# Altium project CSN_Edu_Mod.PrjPCB
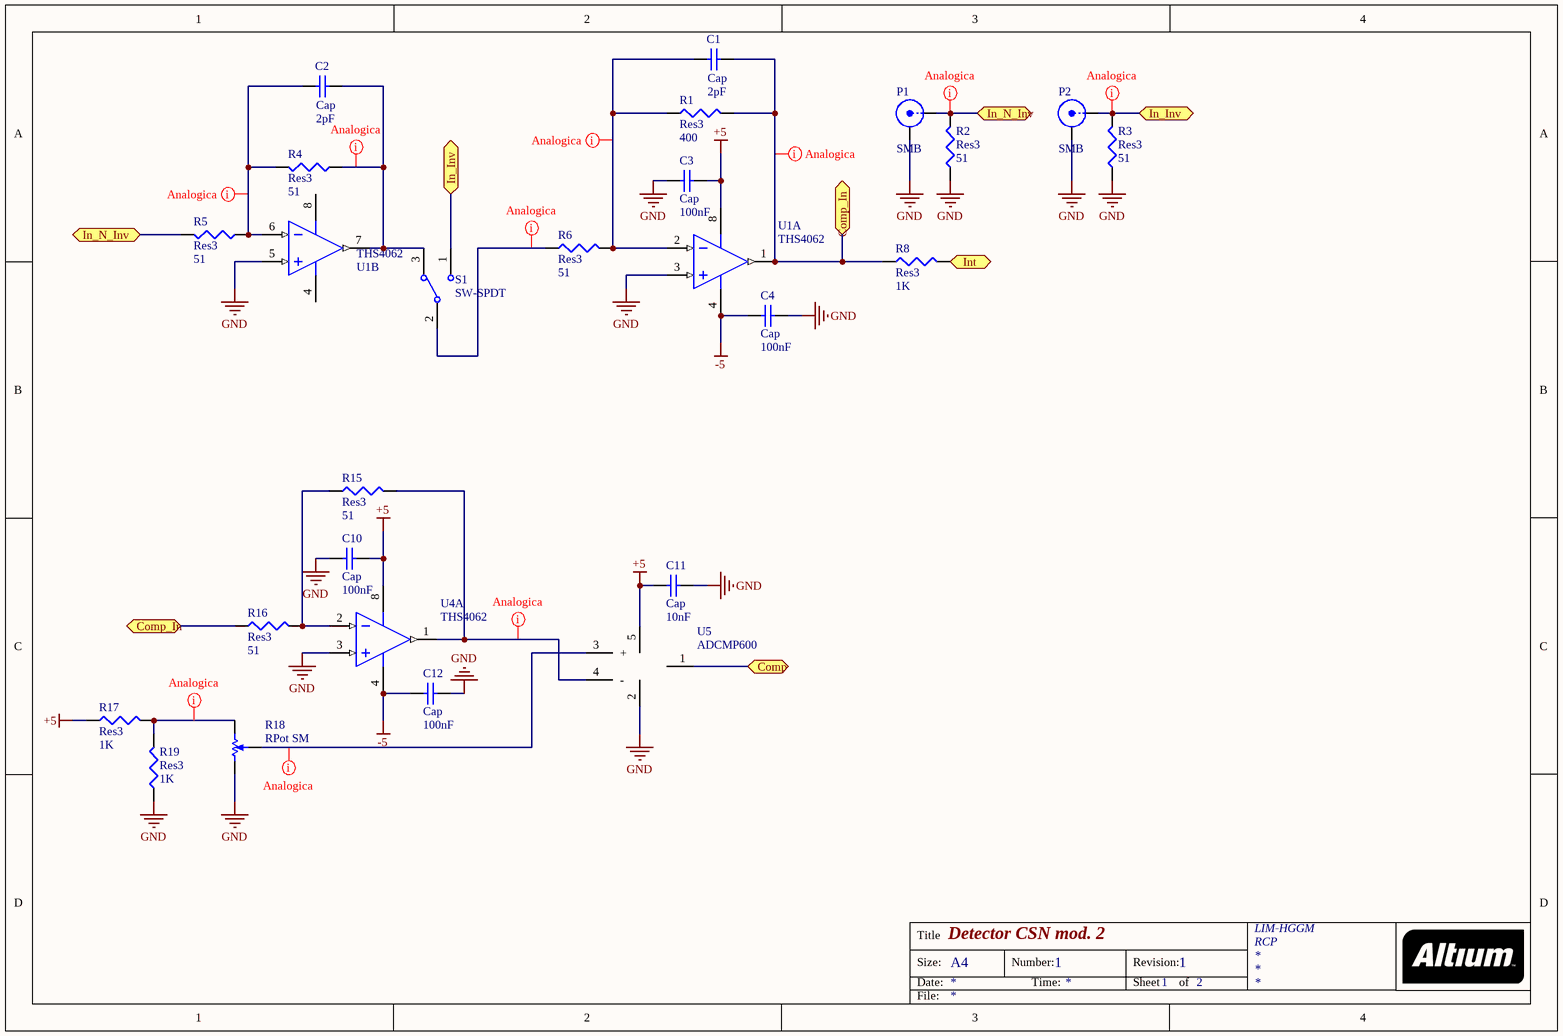
[diagram p0: Sheet1.SchDoc]
2 sheets, 44 parts. Net scope: flat (ports and power ports of the same name join across sheets).
Board file: PCB1.PcbDoc
Sheets:
  Sheet1.SchDoc
  Sheet2.SchDoc

## Sheet Sheet1.SchDoc: Detector CSN mod. 2
size A4; DrawnBy: RCP; Engineer: RCP; Organization: LIM-HGGM; Address1: RCP; DocumentNumber: 1; Revision: 1; SheetNumber: 1; SheetTotal: 2; PageSetup: Record=PageOptions|CenterHorizontal=True|CenterVertical=True|PrintScale=0.97|XCorrection=1.00|YCorrection=1.00|PrintKind=0|BorderSize=5000000|LeftOffset=0|BottomOffset=0|Orientation=2|PaperLength=1000|PaperWidth=1000|Scale=100|PaperSource=7|PrintQuality=-4|MediaType=1|DitherType=10|PaperKind=A4|PrintScaleMode=1

### Parts
C1  Cap  value 2pF  [6-0805_N]
C2  Cap  value 2pF  [6-0805_N]
C3  Cap  value 100nF  [6-0805_N]
C4  Cap  value 100nF  [6-0805_N]
C10  Cap  value 100nF  [6-0805_N]
C11  Cap  value 10nF  [6-0805_N]
C12  Cap  value 100nF  [6-0805_N]
P1  SMB  [SMB_V-RJ45]
P2  SMB  [SMB_V-RJ45]
R1  Res3  value 400  [6-0805_N]
R2  Res3  value 51  [6-0805_N]
R3  Res3  value 51  [6-0805_N]
R4  Res3  value 51  [6-0805_N]
R5  Res3  value 51  [6-0805_N]
R6  Res3  value 51  [6-0805_N]
R8  Res3  value 1K  [6-0805_N]
R15  Res3  value 51  [6-0805_N]
R16  Res3  value 51  [6-0805_N]
R17  Res3  value 1K  [6-0805_N]
R18  RPot SM  [POT4MM-2]
R19  Res3  value 1K  [6-0805_N]
S1  SW-SPDT  [HDR1X3]
U1  THS4062  [S8_N]  (parts A,B of 2)
U4  THS4062  [S8_N]  (part A of 2)
U5  ADCMP600  [SOT23-5_N]

### Ports
Comp, Comp_In, In_Inv, In_N_Inv, Int (out)

### Nets
+5: C3.2 C10.2 C11.1 R17.1 U1.8(V+) U4.8(V+) U5.5
-5: C4.1 C12.1 U1.4(V-) U4.4(V-)
GND: C3.1 C4.2 C10.1 C11.2 C12.2 P1.2(Y) P2.2(Y) R2.1 R3.1 R18.CCW(-) R19.1 U1.3(IN+) U1.5(IN+) U4.3(IN+) U5.2
NetC1_1: C1.1 R1.1 R6.2 U1.2(IN-)
NetC1_2: C1.2 R1.2 R8.1 R16.1 U1.1(OUT) ; port Comp_In
NetC2_1: C2.1 R4.2 R5.1 U1.6(IN-)
NetC2_2: C2.2 R4.1 S1.3 U1.7(OUT)
NetC14_1: R8.2 ; port Int
NetP1_1: P1.1(X) R2.2 R5.2 ; port In_N_Inv
NetP2_1: P2.1(X) R3.2 S1.1 ; port In_Inv
NetP5_6: U5.1 ; port Comp
NetR6_1: R6.1 S1.2
NetR15_1: R15.1 R16.2 U4.2(IN-)
NetR15_2: R15.2 U4.1(OUT) U5.4(-)
NetR17_2: R17.2 R18.CW(+) R19.2
NetR18_W: R18.W U5.3(+)

### Layout directives
net class analog: NetC1_1, NetC1_2, NetC2_1, NetC2_2, NetP1_1, NetP2_1, NetR6_1, NetR15_2, NetR17_2, NetR18_W

### Notes on the sheet
- Title
- Size:
- Date:
- A4
- Number:
- Time:
- Revision:
- Sheet
- of
- File:

### Library data of the parts
C1-C4 C10-C12 = Cap: Capacitor; Published: 8-Jun-2000; LatestRevisionDate: 17-Jul-2002; LatestRevisionNote: Re-released for DXP Platform.; PackageReference: RAD-0.3; Publisher: Altium Limited; PackageDescription: Radial Cap, Thru-Hole; 2 Leads; 0.3 in Pin Spacing
P1 P2 = SMB: SMB Straight Connector; LatestRevisionDate: 17-Jul-2002; LatestRevisionNote: Re-released for DXP Platform.; Publisher: Altium Limited
R1-R6 R8 R15-R17 R19 = Res3: Resistor; Published: 8-Jun-2000; LatestRevisionDate: 29-May-2009; LatestRevisionNote: IPC-7351 Footprint Added.; PackageReference: J1-0603; Publisher: Altium Limited; PackageDescription: Chip Resistor
R18 = RPot SM: Square Trimming Potentiometer; Published: 17-Dec-2003; DatasheetVersion: Oct-2003; PackageReference: POT4MM-2; Publisher: Altium Limited; PackageDescription: Square Trimming Potentiometer; ComponentLink1Description: Manufacturer Link; ComponentLink1URL: http://bourns.com/2/search.html
S1 = SW-SPDT: SPDT Subminiature Toggle Switch, Right Angle Mounting, Vertical Actuation; Published: 24-Mar-1999; LatestRevisionDate: 17-Dec-2003; LatestRevisionNote: Schematic revised, PCB Footprint replaced.; DatasheetVersion: 05-Dec-2000; PackageReference: TL36WW15050; Publisher: Altium Limited; PackageDescription: Switch; 4 Leads; ComponentLink1Description: Manufacturer Link; ComponentLink1URL: http://www.apem.com
U1 U4 = LT1253CS8: Low Cost Dual Video Amplifier; Note: 1003; Published: 8-Jun-2000; LatestRevisionDate: 13-Apr-2006; LatestRevisionNote: IPC-7351 Footprint Added.; DatasheetVersion: 1996; PackageReference: S8; Publisher: Altium Limited; PackageDescription: 8-Pin Small Outline Integrated Circuit 1.27 mm Pitch; Code_JEDEC: MS-012-AA; Code_IPC: SOIC127P600-8; ComponentLink1Description: Manufacturer Link; ComponentLink1URL: http://www.linear.com/; ComponentLink2Description: Datasheet; ComponentLink2URL: http://www.linear.com/pc/downloadDocument.do?navId=H0,C1,C1154,C1009,C1022,P1423,D1129

## Sheet Sheet2.SchDoc: Detector CSN mod. 2
size A4; DrawnBy: RCP; Engineer: RCP; Organization: LIM-HGGM; Address1: RCP; DocumentNumber: 1; Revision: 1; SheetNumber: 2; SheetTotal: 2
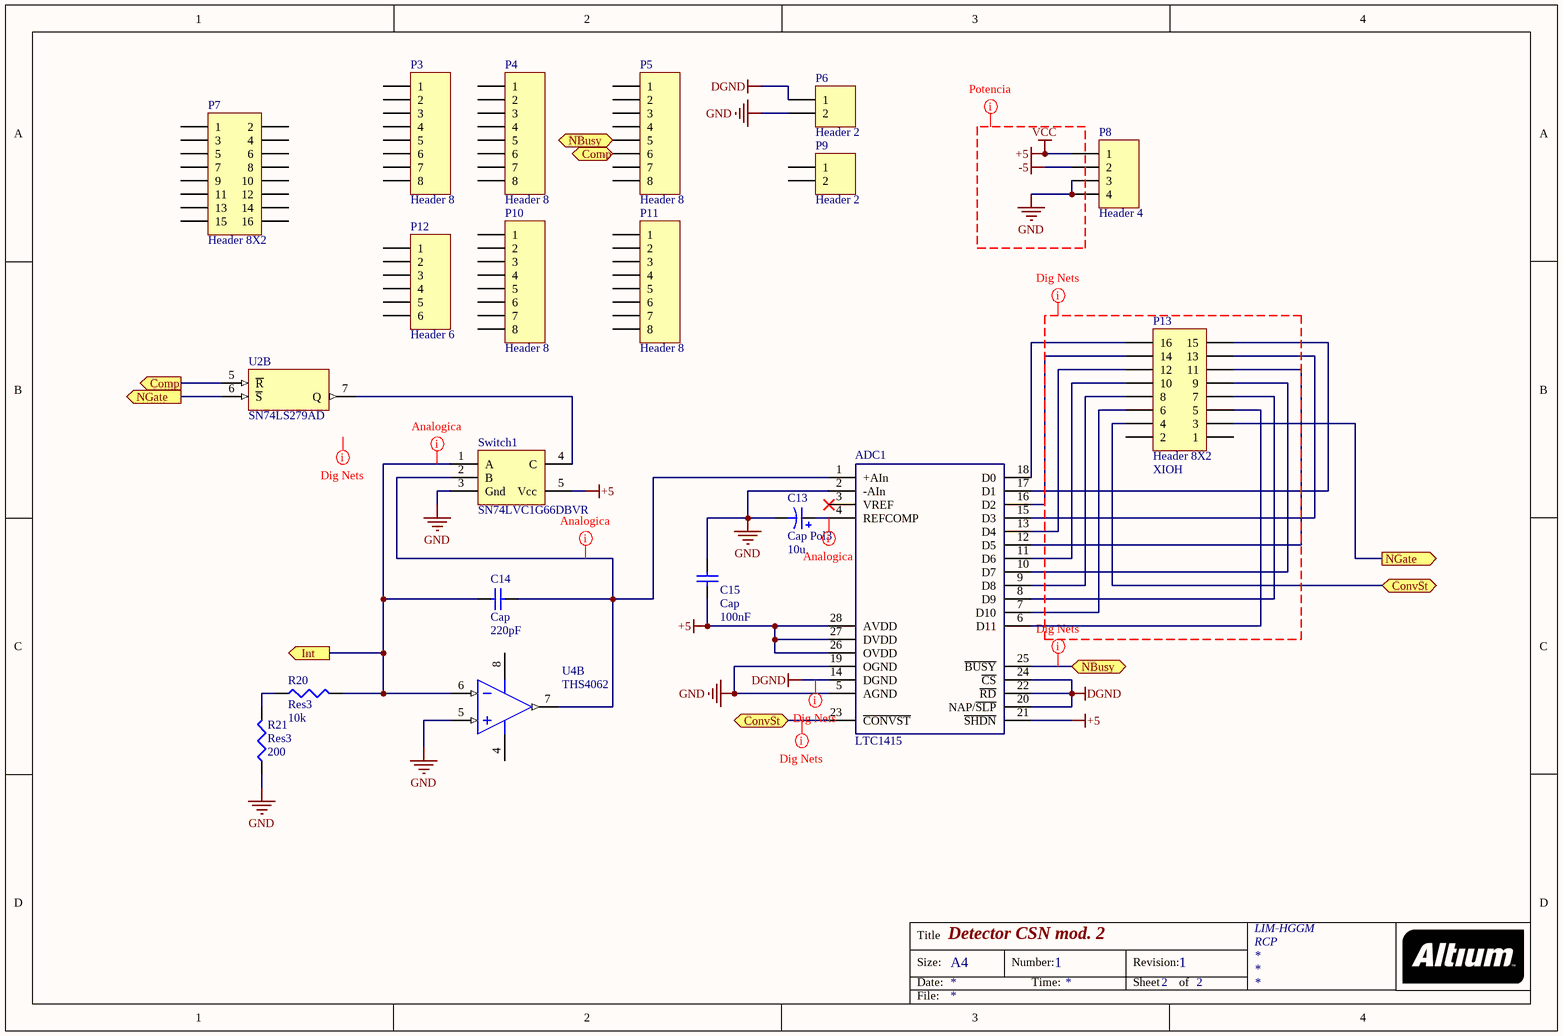
[diagram p1: Sheet2.SchDoc]

### Parts
ADC1  LTC1415  [SO28_N]
C13  Cap Pol3  value 10u  [C0805]
C14  Cap  value 220pF  [6-0805_N]
C15  Cap  value 100nF  [6-0805_N]
P3  Header 8  [HDR1X8]
P4  Header 8  [HDR1X8]
P5  Header 8  [HDR1X8]
P6  Header 2  [HDR1X2]
P7  Header 8X2  [HDR2X8]
P8  Header 4  [HDR1X4]
P9  Header 2  [HDR1X2]
P10  Header 8  [HDR1X8]
P11  Header 8  [HDR1X8]
P12  Header 6  [HDR1X6]
P13  Header 8X2  Con_Arduino: XIOH  [HDR2X8]
R20  Res3  value 10k  [6-0805_N]
R21  Res3  value 200  [6-0805_N]
Switch1  SN74LVC1G66DBVR  [SOT23-5_N]
U2  SN74LS279AD  [D016_N]  (part B of 4)
U4  THS4062  [S8_N]  (part B of 2)

### Ports
Comp (out), ConvSt, Int (out), NBusy, NGate (out)

### Nets
+5: ADC1.21(~{SHDN}) ADC1.26(OVDD) ADC1.27(DVDD) ADC1.28(AVDD) C15.1 P8.1 Switch1.5(Vcc) U2.16(VCC) U4.8(V+)  [also labelled VCC]
-5: P8.2 U4.4(V-)
DGND: ADC1.14(DGND) ADC1.20(NAP/~{SLP}) ADC1.22(~{RD}) ADC1.24(~{CS}) P6.1
GND: ADC1.2(-AIn) ADC1.5(AGND) ADC1.19(OGND) C13.2 C15.2 P6.2 P8.3 P8.4 R21.1 Switch1.3(Gnd) U2.8(GND) U4.5(IN+)
NetADC1_1: ADC1.1(+AIn) C14.2 Switch1.2(B) U4.7(OUT)
NetADC1_4: ADC1.4(REFCOMP) C13.1
NetADC1_6: ADC1.6(D11) P13.5
NetADC1_7: ADC1.7(D10) P13.6
NetADC1_8: ADC1.8(D9) P13.7
NetADC1_9: ADC1.9(D8) P13.8
NetADC1_10: ADC1.10(D7) P13.9
NetADC1_11: ADC1.11(D6) P13.10
NetADC1_12: ADC1.12(D5) P13.11
NetADC1_13: ADC1.13(D4) P13.12
NetADC1_15: ADC1.15(D3) P13.13
NetADC1_16: ADC1.16(D2) P13.14
NetADC1_17: ADC1.17(D1) P13.15
NetADC1_18: ADC1.18(D0) P13.16
NetADC1_23: ADC1.23(~{CONVST}) P13.4 ; port ConvSt
NetADC1_25: ADC1.25(~{BUSY}) P5.5 ; port NBusy
NetC14_1: C14.1 R20.2 Switch1.1(A) U4.6(IN-) ; port Int
NetP5_6: P5.6 U2.5(~{R}) ; port Comp
NetP13_3: P13.3 U2.6(~{S}) ; port NGate
NetR20_1: R20.1 R21.2
NetSwitch1_4: Switch1.4(C) U2.7(Q)

Not connected (* = marked no-connect by the designer): ADC1 3(VREF)*; P3 1 2 3 4 5 6 7 8; P4 1 2 3 4 5 6 7 8; P5 1 2 3 4 7 8; P7 1 2 3 4 5 6 7 8 9 10 11 12 13 14 15 16; P9 1 2; P10 1 2 3 4 5 6 7 8; P11 1 2 3 4 5 6 7 8; P12 1 2 3 4 5 6; P13 1 2

### Layout directives
net class digital: (no net found under the mark), DGND, NetADC1_23, NetADC1_25
net class potencia: +5, -5, GND, VCC
net class analog: NetADC1_1, NetADC1_4, NetC14_1

### Notes on the sheet
- Title
- Size:
- Date:
- A4
- Number:
- Time:
- Revision:
- Sheet
- of
- File:

### Library data of the parts
C13 = Cap Pol3: Polarized Capacitor (Surface Mount); Published: 8-Jun-2000; LatestRevisionDate: 29-May-2009; LatestRevisionNote: IPC-7351 Footprint Added.; PackageReference: C0805; Publisher: Altium Limited; PackageDescription: Chip Capacitor
C14 C15 = Cap: Capacitor; Published: 8-Jun-2000; LatestRevisionDate: 17-Jul-2002; LatestRevisionNote: Re-released for DXP Platform.; PackageReference: RAD-0.3; Publisher: Altium Limited; PackageDescription: Radial Cap, Thru-Hole; 2 Leads; 0.3 in Pin Spacing
P3-P5 P10 P11 = Header 8: Header, 8-Pin; LatestRevisionDate: 17-Jul-2002; LatestRevisionNote: Re-released for DXP Platform.; Publisher: Altium Limited
P6 P9 = Header 2: Header, 2-Pin; LatestRevisionDate: 17-Jul-2002; LatestRevisionNote: Re-released for DXP Platform.; Publisher: Altium Limited
P7 P13 = Header 8X2: Header, 8-Pin, Dual row; LatestRevisionDate: 17-Jul-2002; LatestRevisionNote: Re-released for DXP Platform.; Publisher: Altium Limited
P8 = Header 4: Header, 4-Pin; LatestRevisionDate: 17-Jul-2002; LatestRevisionNote: Re-released for DXP Platform.; Publisher: Altium Limited
P12 = Header 6: Header, 6-Pin; LatestRevisionDate: 17-Jul-2002; LatestRevisionNote: Re-released for DXP Platform.; Publisher: Altium Limited
R20 R21 = Res3: Resistor; Published: 8-Jun-2000; LatestRevisionDate: 29-May-2009; LatestRevisionNote: IPC-7351 Footprint Added.; PackageReference: J1-0603; Publisher: Altium Limited; PackageDescription: Chip Resistor
U2 = SN74LS279AD: Quadruple S-R Latches; Published: 8-Jun-2000; LatestRevisionDate: 13-Apr-2006; LatestRevisionNote: IPC-7351 Footprint Added.; DatasheetVersion: Mar-1988; PackageVersion: Jan-1998; PackageReference: D016; Publisher: Altium Limited; PackageDescription: 16-Pin Small Outline Integrated Circuit 1.27 mm Pitch; Code_IPC: SOIC127P600-16; ComponentLink1Description: Manufacturer Link; ComponentLink1URL: http://www.ti.com/; ComponentLink2Description: Datasheet; ComponentLink2URL: http://www-s.ti.com/sc/ds/sn54279.pdf
U4 = LT1253CS8: as U1 on sheet Sheet1; Published: 8-Jun-2000; LatestRevisionDate: 13-Apr-2006; LatestRevisionNote: IPC-7351 Footprint Added.; DatasheetVersion: 1996; PackageReference: S8; Publisher: Altium Limited; PackageDescription: 8-Pin Small Outline Integrated Circuit 1.27 mm Pitch; Code_JEDEC: MS-012-AA; Code_IPC: SOIC127P600-8; ComponentLink1Description: Manufacturer Link; ComponentLink1URL: http://www.linear.com/; ComponentLink2Description: Datasheet; ComponentLink2URL: http://www.linear.com/pc/downloadDocument.do?navId=H0,C1,C1154,C1009,C1022,P1423,D1129

## Nets that join several sheets
+5: Sheet1 (7 pins), Sheet2 (9 pins)
-5: Sheet1 (C4.1 C12.1 U1.4 U4.4), Sheet2 (P8.2 U4.4)
GND: Sheet1 (15 pins), Sheet2 (12 pins)
NetC14_1: Sheet1 (R8.2), Sheet2 (C14.1 R20.2 Switch1.1 U4.6)
NetP5_6: Sheet1 (U5.1), Sheet2 (P5.6 U2.5)